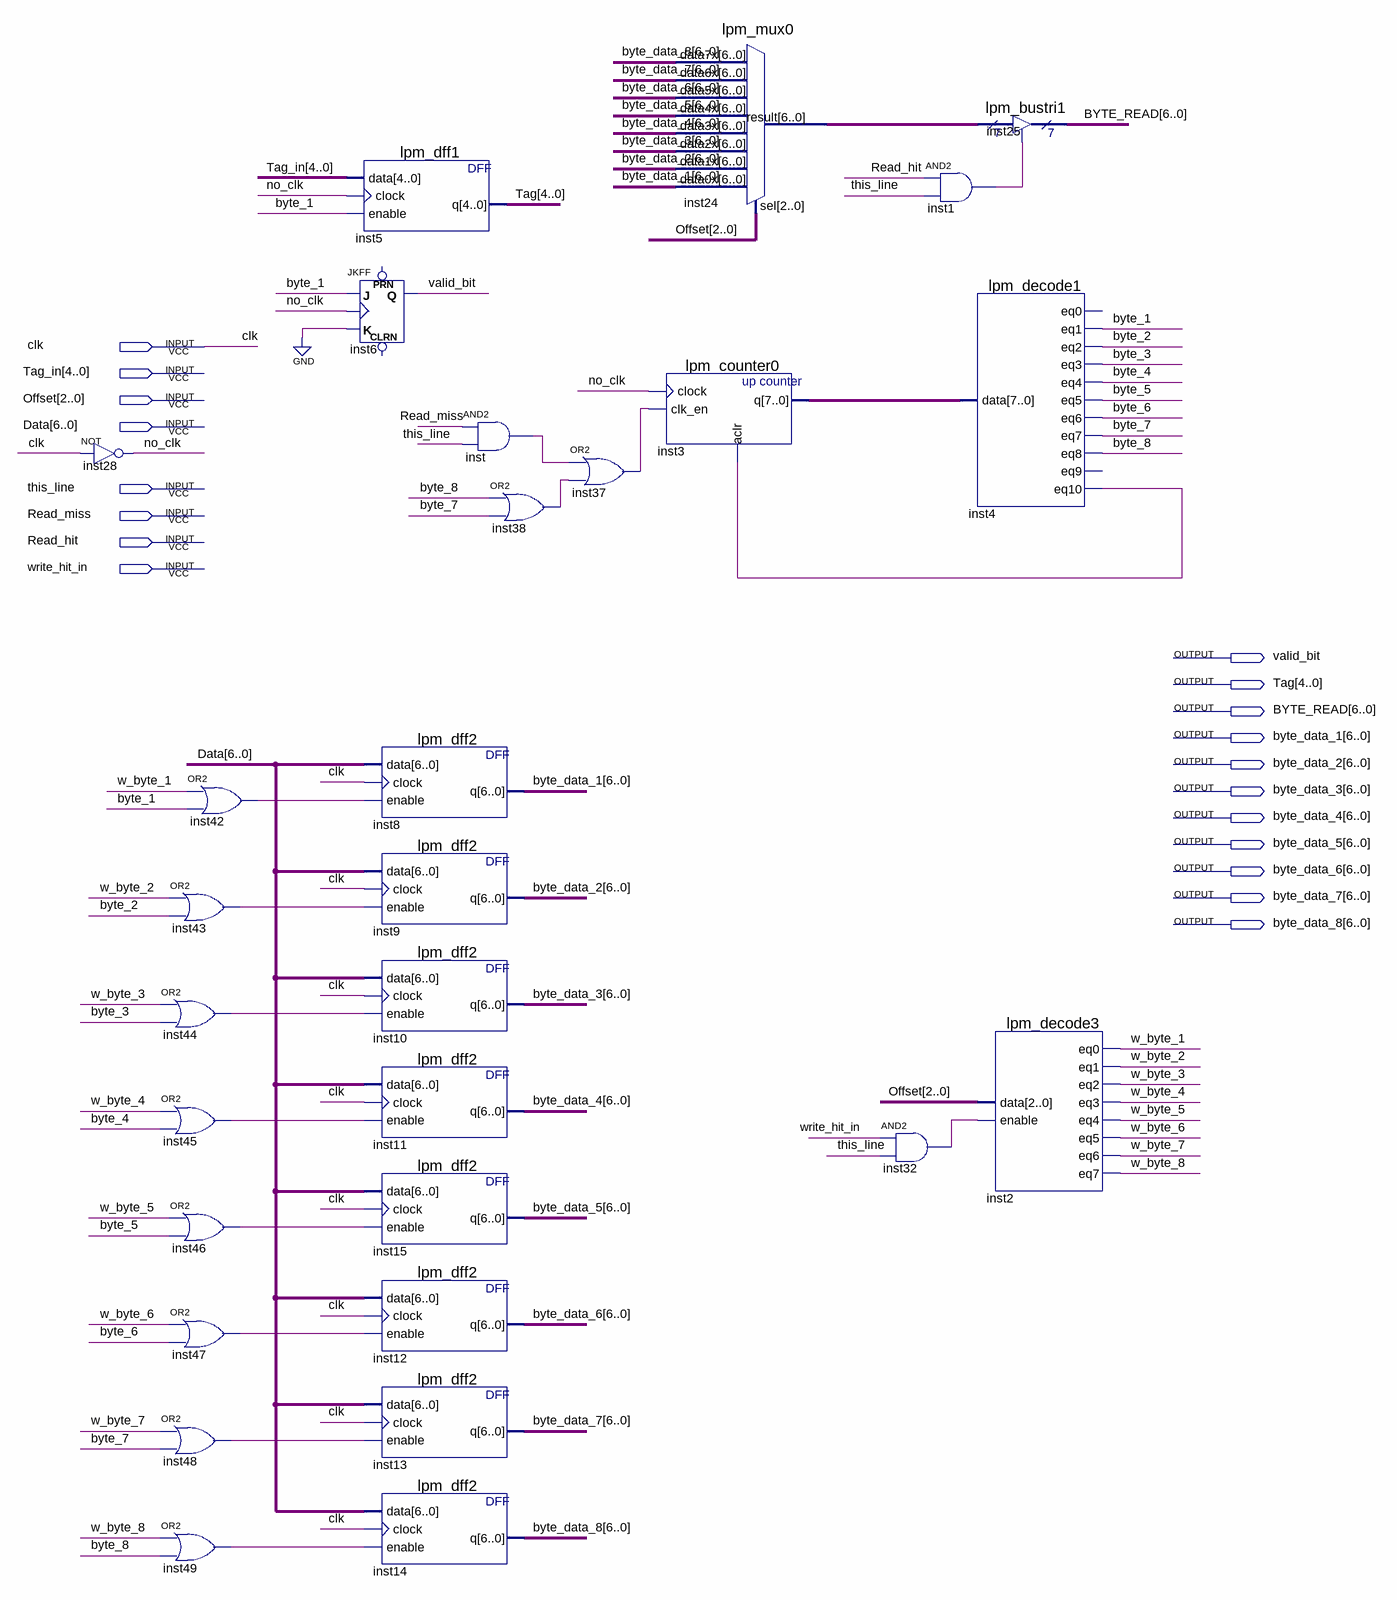
[diagram p0: schematic sheet]
// Quartus schematic LINE.bdf as structural Verilog: 29 symbols, 19 pins
module LINE (
  input  clk,
  input  [4:0] Tag_in,
  input  [2:0] Offset,
  input  [6:0] Data,
  input  this_line,
  input  Read_miss,
  input  Read_hit,
  input  write_hit_in,
  output valid_bit,
  output [4:0] Tag,
  output [6:0] BYTE_READ,
  output [6:0] byte_data_1,
  output [6:0] byte_data_2,
  output [6:0] byte_data_3,
  output [6:0] byte_data_4,
  output [6:0] byte_data_5,
  output [6:0] byte_data_6,
  output [6:0] byte_data_7,
  output [6:0] byte_data_8
);

  wire byte_1, byte_2, byte_3, byte_4, byte_5, byte_6, byte_7, byte_8, inst1_out, inst4_eq10, inst32_out,
       inst37_out, inst38_out, inst42_out, inst43_out, inst44_out, inst45_out, inst46_out, inst47_out,
       inst48_out, inst49_out, inst_out, no_clk, w_byte_1, w_byte_2, w_byte_3, w_byte_4, w_byte_5, w_byte_6,
       w_byte_7, w_byte_8;
  wire [6:0] inst24_result;
  wire [7:0] inst3_q;

  not inst28 (no_clk, clk);
  or inst43 (inst43_out, w_byte_2, byte_2);
  or inst44 (inst44_out, w_byte_3, byte_3);
  or inst45 (inst45_out, w_byte_4, byte_4);
  or inst46 (inst46_out, w_byte_5, byte_5);
  or inst47 (inst47_out, w_byte_6, byte_6);
  or inst48 (inst48_out, w_byte_7, byte_7);
  or inst49 (inst49_out, w_byte_8, byte_8);
  or inst42 (inst42_out, w_byte_1, byte_1);
  lpm_dff1 inst5 (.data(Tag_in), .clock(no_clk), .enable(byte_1), .q(Tag));
  JKFF inst6 (.K(1'b0), .J(byte_1), .CLK(no_clk), .Q(valid_bit));  // open: PRN, CLRN
  lpm_dff2 inst8 (.data(Data), .clock(clk), .enable(inst42_out), .q(byte_data_1));
  lpm_dff2 inst9 (.data(Data), .clock(clk), .enable(inst43_out), .q(byte_data_2));
  lpm_dff2 inst10 (.data(Data), .clock(clk), .enable(inst44_out), .q(byte_data_3));
  lpm_dff2 inst11 (.data(Data), .clock(clk), .enable(inst45_out), .q(byte_data_4));
  lpm_dff2 inst15 (.data(Data), .clock(clk), .enable(inst46_out), .q(byte_data_5));
  lpm_dff2 inst12 (.data(Data), .clock(clk), .enable(inst47_out), .q(byte_data_6));
  lpm_dff2 inst13 (.data(Data), .clock(clk), .enable(inst48_out), .q(byte_data_7));
  lpm_dff2 inst14 (.data(Data), .clock(clk), .enable(inst49_out), .q(byte_data_8));
  and inst (inst_out, Read_miss, this_line);
  or inst38 (inst38_out, byte_8, byte_7);
  or inst37 (inst37_out, inst_out, inst38_out);
  lpm_mux0 inst24 (
    .data7x(byte_data_8), .data6x(byte_data_7), .data5x(byte_data_6), .data4x(byte_data_5),
    .data3x(byte_data_4), .data2x(byte_data_3), .data1x(byte_data_2), .data0x(byte_data_1), .sel(Offset),
    .result(inst24_result));
  lpm_counter0 inst3 (.clock(no_clk), .clk_en(inst37_out), .aclr(inst4_eq10), .q(inst3_q));
  and inst32 (inst32_out, write_hit_in, this_line);
  and inst1 (inst1_out, Read_hit, this_line);
  lpm_decode1 inst4 (
    .data(inst3_q), .eq1(byte_1), .eq2(byte_2), .eq3(byte_3), .eq4(byte_4), .eq5(byte_5), .eq6(byte_6),
    .eq7(byte_7), .eq8(byte_8), .eq10(inst4_eq10));  // open: eq0, eq9
  lpm_bustri1 inst25 (.enabledt(inst1_out), .data(inst24_result), .tridata(BYTE_READ));
  lpm_decode3 inst2 (
    .data(Offset), .enable(inst32_out), .eq0(w_byte_1), .eq1(w_byte_2), .eq2(w_byte_3), .eq3(w_byte_4),
    .eq4(w_byte_5), .eq5(w_byte_6), .eq6(w_byte_7), .eq7(w_byte_8));
endmodule
